# Altium schematic sheet ZP.SchDoc: ZP
size OrCAD A; DocumentNumber: LM-002; Revision: F; SheetNumber: 5; SheetTotal: 5
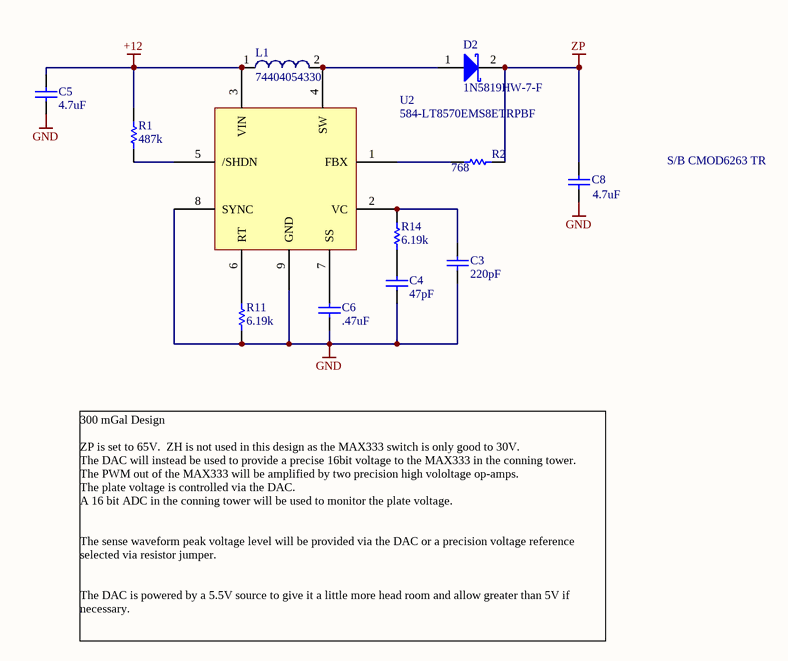
[diagram p0: ZP.SchDoc]

## Parts
C3  220pF  [CAPC0402(1005)60_L]
C4  47pF  [CAPC0402(1005)60_L]
C5  4.7uF  [CAPC0805(2012)155_L]
C6  .47uF  [CAPC0402(1005)60_L]
C8  Capacitance: 4.7uF  [CAPC0805(2012)155_L]  (hidden comment: CAP CER 1UF 25V X7R 0805)
D2  1N5819HW-7-F  [DIOD-SOD-123-2_V]
L1  74404054330  [WE-LQS 5040]
R1  487k  [RESC0402(1005)_M]
R2  768  [RESC0402(1005)_M]
R11  6.19k  [RESC0402(1005)_M]
R14  6.19k  [RESC0402(1005)_M]
U2  Supplier Part Number 1: 584-LT8570EMS8ETRPBF  [LT8570-MSOP]  (hidden comment: LT8570)

## Nets
+12: C5.2 L1.1 R1.1 U2.3(VIN)
GND: C3.1 C4.1 C5.1 C6.1 C8.1 R11.2 U2.8(SYNC) U2.9(GND)
ZP: C8.2 D2.2(K) R2.2
NetC3_2: C3.2 R14.1 U2.2(VC)
NetC4_2: C4.2 R14.2
NetC6_2: C6.2 U2.7(SS)
NetD2_1: D2.1(A) L1.2 U2.4(SW)
NetR1_2: R1.2 U2.5(/SHDN)
NetR2_1: R2.1 U2.1(FBX)
NetR11_1: R11.1 U2.6(RT)

## Notes on the sheet
- S/B CMOD6263 TR
- 300 mGal Design
  ZP is set to 65V.  ZH is not used in this design as the MAX333 switch is only good to 30V.
  The DAC will instead be used to provide a precise 16bit voltage to the MAX333 in the conning tower.
  The PWM out of the MAX333 will be amplified by two precision high vololtage op-amps.
  The plate voltage is controlled via the DAC.
  A 16 bit ADC in the conning tower will be used to monitor the plate voltage.
  The sense waveform peak voltage level will be provided via the DAC or a precision voltage reference selected via resistor jumper.
  The DAC is powered by a 5.5V source to give it a little more head room and allow greater than 5V if necessary.
- Title
- Size:
- Date:
- Orcad A
- Number:
- Time:
- Revision:
- Sheet
- of
- ZLS Corporation
- 7801 North Lamar Blvd.
- Suite E-184
- Austin, Texas 78752  USA
- (512) 453-0288
- File:

## Library data of the parts
C3 C4 C6 = CMP-1034-00252-1: CAP CER 0.1UF 10V X7R 0402
C5 = CMP-1036-04882-1
C8 = CMP-1036-04882-1: Manufacturer: Murata Electronics North America; Manufacturer Part Number: GRM21BR71E105KA99L; Tolerance: ±10%; Supplier 1: Digi-Key; Supplier Part Number 1: 490-6484-6-ND; RoHS: RoHS Compliant; Category: Capacitors; Stock 1: 295074; Pricing 1: 1=0.14, 10=0.099, 100=0.0468, 500=0.0328, 1000=0.02715 (USD); Packaging: Digi-Reel®; Part Status: Active; Voltage - Rated: 25V; Temperature Coefficient: X7R; Operating Temperature: -55°C ~ 125°C; Features: -; Ratings: -; Applications: General Purpose; Mounting Type: Surface Mount, MLCC; Package / Case: 0805 (2012 Metric); Size / Dimension: 0.079" L x 0.049" W (2.00mm x 1.25mm); Height - Seated (Max): -; Thickness (Max): 0.053" (1.35mm); Lead Spacing: -; Lead Style: -; ComponentLink1URL: http://www.murata.com/~/media/webrenewal/support/library/catalog/products/capacitor/mlcc/c02e.ashx; ComponentLink1Description: http://www.murata.com/~/media/webrenewal/support/library/catalog/products/capacitor/mlcc/c02e.ashx
D2 = CMP-0303-00003-1: 1.0 A Surface Mount Schottky Barrier Rectifier, 40 V, -65 to 125 degC, 2-Pin SOD-123 Package, RoHS, Tape and Reel; Manufacturer: Diodes Inc; @ VR (V): 40; @ Terminal Temperature TT (degC): 90; Maximum Average Rectified Current IO (A): 1; Total Capacitance CT (pF): 50; Peak Forward Surge Current IFSM (A): 25; Forward Voltage Drop VF (V): 0.45; VR (RMS) (V): 28; RoHS: TRUE; PartNumber: 1N5819HW-7-F; ComponentLink2URL: http://www.diodes.com/datasheets/ds30217.pdf; PackageDescription: 2-Pin SOD-123, Body 2.7 x 1.55 mm, Pitch 3.7 mm; @ IF (A): 1; Operating and Storage Temperature Range: -65 to 125 degC; ComponentLink1Description: Manufacturer URL; ComponentLink2Description: Datasheet; ComponentLink1URL: http://www.diodes.com/; Mounting Technology: Surface Mount; DatasheetVersion: Rev. 15-2; PackageReference: SOD-123-2; Maximum Reverse Current IR (uA): 50; Peak Repetitive Reverse Voltage VRRM (V): 40; Packing: Tape and Reel
L1 = CMP-1354-00041-1: WE-LQS SMD Power Inductor, L=33.0 µH; Manufacturer: Wuerth Elektronik; Inductance: 33.0 ÂµH; PackageReference: WE-LQS 5040; ComponentLink1URL: http://www.we-online.com; ComponentLink2URL: http://katalog.we-online.de/pbs/datasheet/74404054330.pdf; ComponentLink2Description: Datasheet; PartNumber: 74404054330; ComponentLink1Description: Manufacturer URL
R1 R2 R11 R14 = CMP-1011-00463-1
U2 = LT8570: IC REG MULT CONFIG INV ADJ 8MSOP; Supplier 1: Mouser